# Altium schematic sheet shouhj.SchDoc
size A4
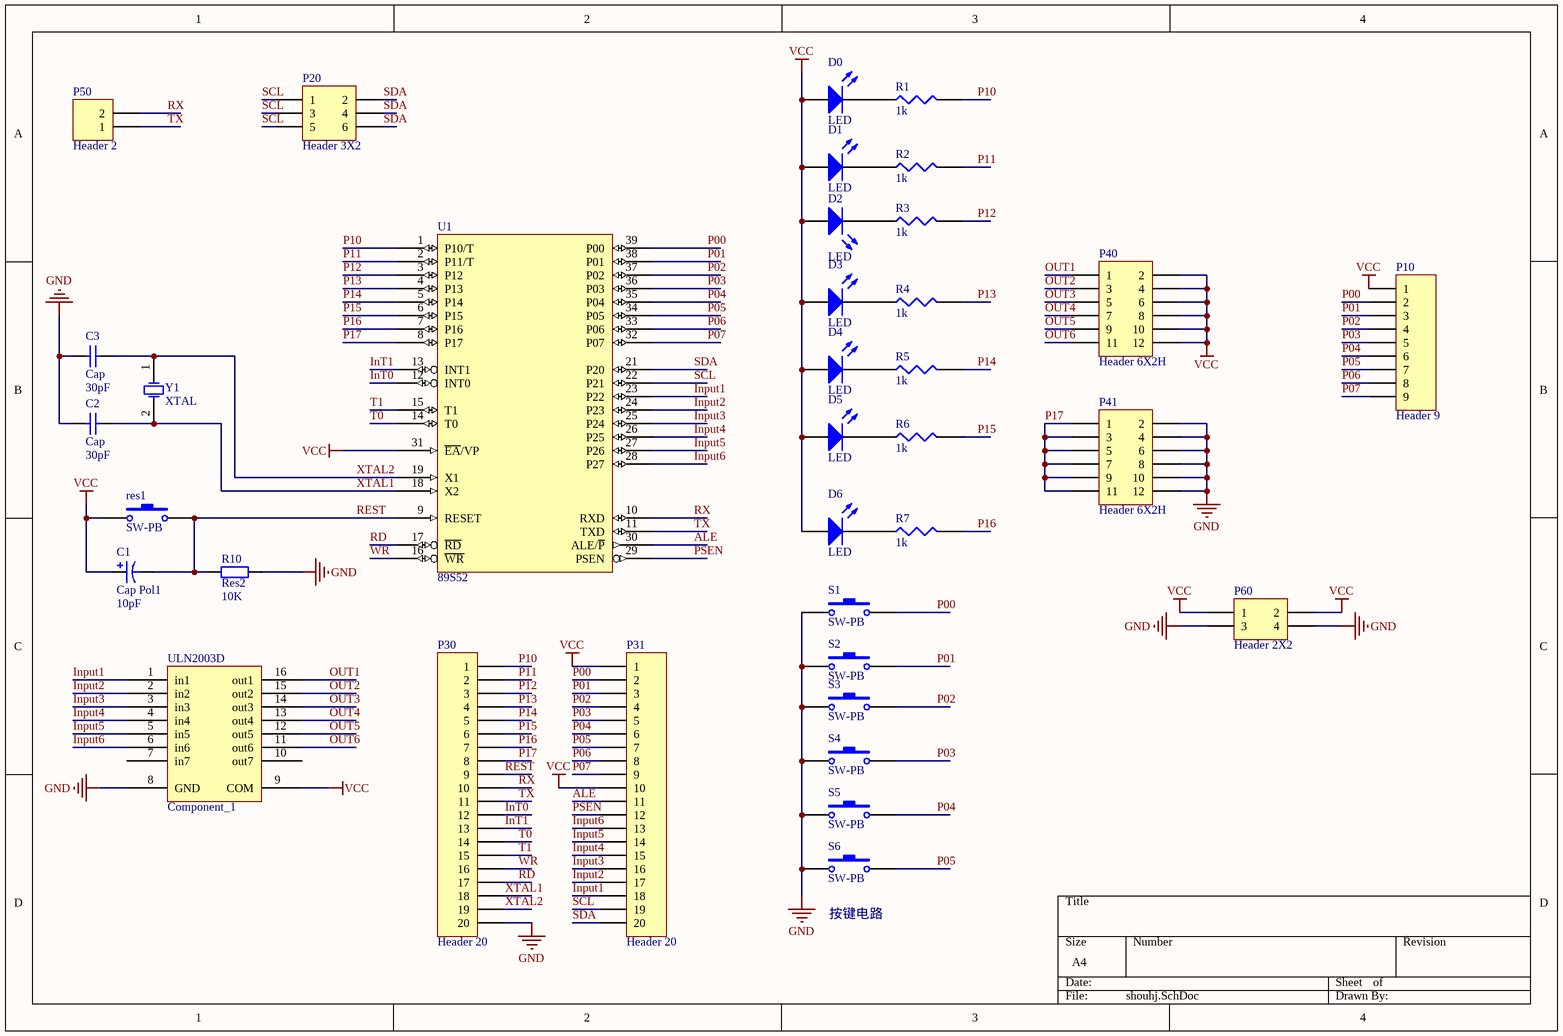
[diagram p0: shouhj.SchDoc]

## Parts
C1  Cap Pol1  value 10pF  [RB7.6-15]
C2  Cap  value 30pF  [CAPR5-4X5]
C3  Cap  value 30pF  [CAPR5-4X5]
D0  LED  [My_LED3MM]
D1  LED  [My_LED3MM]
D2  LED  [My_LED3MM]
D3  LED  [My_LED3MM]
D4  LED  [My_LED3MM]
D5  LED  [My_LED3MM]
D6  LED  [My_LED3MM]
P10  Header 9  [HDR1X9]
P20  Header 3X2  [HDR2X3]
P30  Header 20  [HDR1X20]
P31  Header 20  [HDR1X20]
P40  Header 6X2H  [HDR2X6]
P41  Header 6X2H  [HDR2X6]
P50  Header 2  [HDR1X2]
P60  Header 2X2  [HDR2X2]
R1  1k  [My_axial-0.4]
R2  1k  [My_axial-0.4]
R3  1k  [My_axial-0.4]
R4  1k  [My_axial-0.4]
R5  1k  [My_axial-0.4]
R6  1k  [My_axial-0.4]
R7  1k  [My_axial-0.4]
R10  Res2  value 10K  [AXIAL-0.4]
res1  SW-PB  [anjian]
S1  SW-PB  [anjian]
S2  SW-PB  [anjian]
S3  SW-PB  [anjian]
S4  SW-PB  [anjian]
S5  SW-PB  [anjian]
S6  SW-PB  [anjian]
U1  89S52  [My_DIP40]
ULN2003D  Component_1  [PCBComponent_1]
Y1  XTAL  [R38]

## Nets
GND: C2.1 C3.2 P30.20 P41.2 P41.4 P41.6 P41.8 P41.10 P41.12 P60.3 P60.4 R10.2 S1.1 S2.1 S3.1 S4.1 S5.1 S6.1 U1.20(GND) ULN2003D.8(GND)
VCC: C1.1 D0.A D1.A D2.A D3.A D4.A D5.A D6.A P10.1 P31.1 P31.10 P40.2 P40.4 P40.6 P40.8 P40.10 P40.12 P60.1 P60.2 res1.1 U1.31(~{EA}/VP) U1.40(VCC) ULN2003D.9(COM)
ALE: P31.11 U1.30(ALE/~{P})
Input1: P31.18 U1.23(P22) ULN2003D.1(in1)
Input2: P31.17 U1.24(P23) ULN2003D.2(in2)
Input3: P31.16 U1.25(P24) ULN2003D.3(in3)
Input4: P31.15 U1.26(P25) ULN2003D.4(in4)
Input5: P31.14 U1.27(P26) ULN2003D.5(in5)
Input6: P31.13 U1.28(P27) ULN2003D.6(in6)
InT0: P30.12 U1.12(INT0)
InT1: P30.13 U1.13(INT1)
OUT1: P40.1 ULN2003D.16(out1)
OUT2: P40.3 ULN2003D.15(out2)
OUT3: P40.5 ULN2003D.14(out3)
OUT4: P40.7 ULN2003D.13(out4)
OUT5: P40.9 ULN2003D.12(out5)
OUT6: P40.11 ULN2003D.11(out6)
P00: P10.2 P31.2 S1.2 U1.39(P00)
P01: P10.3 P31.3 S2.2 U1.38(P01)
P02: P10.4 P31.4 S3.2 U1.37(P02)
P03: P10.5 P31.5 S4.2 U1.36(P03)
P04: P10.6 P31.6 S5.2 U1.35(P04)
P05: P10.7 P31.7 S6.2 U1.34(P05)
P06: P10.8 P31.8 U1.33(P06)
P07: P10.9 P31.9 U1.32(P07)
P10: P30.1 R1.2 U1.1(P10/T)
P11: P30.2 R2.2 U1.2(P11/T)
P12: P30.3 R3.2 U1.3(P12)
P13: P30.4 R4.2 U1.4(P13)
P14: P30.5 R5.2 U1.5(P14)
P15: P30.6 R6.2 U1.6(P15)
P16: P30.7 R7.2 U1.7(P16)
P17: P30.8 P41.1 P41.3 P41.5 P41.7 P41.9 P41.11 U1.8(P17)
PSEN: P31.12 U1.29(PSEN)
RD: P30.17 U1.17(~{RD})
REST: C1.2 P30.9 R10.1 res1.2 U1.9(RESET)
RX: P30.10 P50.2 U1.10(RXD)
SCL: P20.1 P20.3 P20.5 P31.19 U1.22(P21)
SDA: P20.2 P20.4 P20.6 P31.20 U1.21(P20)
T0: P30.14 U1.14(T0)
T1: P30.15 U1.15(T1)
TX: P30.11 P50.1 U1.11(TXD)
WR: P30.16 U1.16(~{WR})
XTAL1: C2.2 P30.18 U1.18(X2) Y1.2(OSC2)
XTAL2: C3.1 P30.19 U1.19(X1) Y1.1(OSC1)
NetD0_K: D0.K R1.1
NetD1_K: D1.K R2.1
NetD2_K: D2.K R3.1
NetD3_K: D3.K R4.1
NetD4_K: D4.K R5.1
NetD5_K: D5.K R6.1
NetD6_K: D6.K R7.1

Not connected (* = marked no-connect by the designer): ULN2003D 7(in7) 10(out7)

## Notes on the sheet
- (near S6) 按键电路

## Library data of the parts
C1 = Cap Pol1: Polarized Capacitor (Radial); Published: 8-Jun-2000; LatestRevisionDate: 17-Jul-2002; LatestRevisionNote: Re-released for DXP Platform.; PackageReference: RB7.6-15; Publisher: Altium Limited; PackageDescription: Polarized Capacitor (Radial); 2 Leads
C2 C3 = Cap: Capacitor; Published: 8-Jun-2000; LatestRevisionDate: 17-Jul-2002; LatestRevisionNote: Re-released for DXP Platform.; PackageReference: RAD-0.3; Publisher: Altium Limited
D0-D6 = LED: Typical INFRARED GaAs LED; Published: 8-Jun-2000; LatestRevisionDate: 08-Jul-2005; LatestRevisionNote: Mech Layer 1 removed.; Publisher: Altium Limited
P10 = Header 9: Header, 9-Pin; LatestRevisionDate: 17-Jul-2002; LatestRevisionNote: Re-released for DXP Platform.; Publisher: Altium Limited
P20 = Header 3X2: Header, 3-Pin, Dual row; LatestRevisionDate: 17-Jul-2002; LatestRevisionNote: Re-released for DXP Platform.; Publisher: Altium Limited
P30 P31 = Header 20: Header, 20-Pin; LatestRevisionDate: 17-Jul-2002; LatestRevisionNote: Re-released for DXP Platform.; Publisher: Altium Limited
P40 P41 = Header 6X2H: Header, 6-Pin, Dual row, Right Angle; LatestRevisionDate: 17-Jul-2002; LatestRevisionNote: Re-released for DXP Platform.; Publisher: Altium Limited
P50 = Header 2: Header, 2-Pin; LatestRevisionDate: 17-Jul-2002; LatestRevisionNote: Re-released for DXP Platform.; Publisher: Altium Limited
P60 = Header 2X2: Header, 2-Pin, Dual row; LatestRevisionDate: 17-Jul-2002; LatestRevisionNote: Re-released for DXP Platform.; Publisher: Altium Limited
R1-R7 = Res: resistor 1/4 wat; Value: 1k
R10 = Res2: Resistor; Published: 8-Jun-2000; LatestRevisionDate: 17-Jul-2002; LatestRevisionNote: Re-released for DXP Platform.; PackageReference: AXIAL-0.4; Publisher: Altium Limited
res1 S1-S6 = SW-PB: Switch; Published: 24-Mar-1999; LatestRevisionDate: 17-Jul-2002; LatestRevisionNote: Re-released for DXP Platform.; PackageReference: SPST-2; Publisher: Altium Limited
U1 = 89S52: Atmel 89S52 Microcontroller
Y1 = XTAL: Crystal Oscillator; Published: 8-Jun-2000; LatestRevisionDate: 17-Jul-2002; LatestRevisionNote: Re-released for DXP Platform.; PackageReference: R38; Publisher: Altium Limited